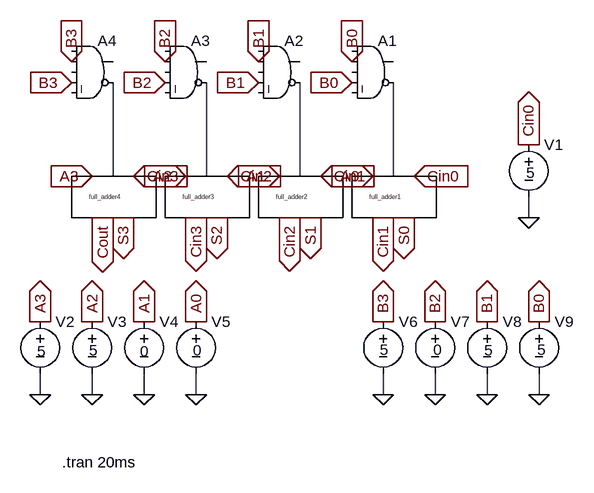
[diagram p0: schematic part3_simulatedCircuit.asc]
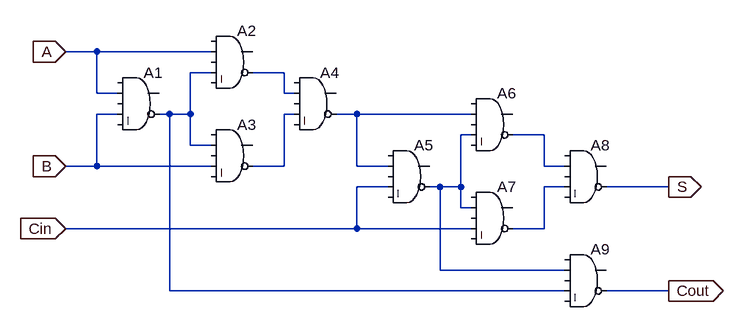
[diagram p1: sub-circuit part1_circuit.asc]
part3_simulatedCircuit.asc, the LTspice schematic file:
Version 4
SHEET 1 880 680
WIRE 0 144 0 0
WIRE 144 144 144 0
WIRE 288 144 288 0
WIRE 432 144 432 0
WIRE 640 208 640 176
WIRE -112 480 -112 448
WIRE -32 480 -32 448
WIRE 48 480 48 448
WIRE 128 480 128 448
WIRE 416 480 416 448
WIRE 496 480 496 448
WIRE 576 480 576 448
WIRE 656 480 656 448
FLAG 368 -32 B0
IOPIN 368 -32 In
FLAG 368 0 B0
IOPIN 368 0 In
FLAG 224 -32 B1
IOPIN 224 -32 In
FLAG 224 0 B1
IOPIN 224 0 In
FLAG 80 -32 B2
IOPIN 80 -32 In
FLAG 80 0 B2
IOPIN 80 0 In
FLAG -64 -32 B3
IOPIN -64 -32 In
FLAG -64 0 B3
IOPIN -64 0 In
FLAG 400 144 A0
IOPIN 400 144 In
FLAG 256 144 A1
IOPIN 256 144 In
FLAG 112 144 A2
IOPIN 112 144 In
FLAG -32 144 A3
IOPIN -32 144 In
FLAG 464 144 Cin0
IOPIN 464 144 In
FLAG 320 144 Cin1
IOPIN 320 144 In
FLAG 176 144 Cin2
IOPIN 176 144 In
FLAG 32 144 Cin3
IOPIN 32 144 In
FLAG 16 208 S3
IOPIN 16 208 Out
FLAG -16 208 Cout
IOPIN -16 208 Out
FLAG 128 208 Cin3
IOPIN 128 208 Out
FLAG 160 208 S2
IOPIN 160 208 Out
FLAG 272 208 Cin2
IOPIN 272 208 Out
FLAG 304 208 S1
IOPIN 304 208 Out
FLAG 416 208 Cin1
IOPIN 416 208 Out
FLAG 448 208 S0
IOPIN 448 208 Out
FLAG 640 208 0
FLAG 416 480 0
FLAG 496 480 0
FLAG 576 480 0
FLAG 656 480 0
FLAG 640 96 Cin0
IOPIN 640 96 Out
FLAG 416 368 B3
IOPIN 416 368 Out
FLAG 496 368 B2
IOPIN 496 368 Out
FLAG 576 368 B1
IOPIN 576 368 Out
FLAG 656 368 B0
IOPIN 656 368 Out
FLAG 128 480 0
FLAG 48 480 0
FLAG -32 480 0
FLAG -112 480 0
FLAG -112 368 A3
IOPIN -112 368 Out
FLAG -32 368 A2
IOPIN -32 368 Out
FLAG 48 368 A1
IOPIN 48 368 Out
FLAG 128 368 A0
IOPIN 128 368 Out
SYMBOL part1_circuit 432 176 R0
SYMATTR InstName full_adder1
SYMBOL part1_circuit 288 176 R0
SYMATTR InstName full_adder2
SYMBOL part1_circuit 144 176 R0
SYMATTR InstName full_adder3
SYMBOL part1_circuit 0 176 R0
SYMATTR InstName full_adder4
SYMBOL Digital\\and 400 -80 R0
SYMATTR InstName A1
SYMBOL Digital\\and 256 -80 R0
SYMATTR InstName A2
SYMBOL Digital\\and 112 -80 R0
SYMATTR InstName A3
SYMBOL Digital\\and -32 -80 R0
SYMATTR InstName A4
SYMBOL voltage 640 80 R0
WINDOW 123 0 0 Left 0
WINDOW 39 0 0 Left 0
WINDOW 3 -4 59 Left 2
SYMATTR InstName V1
SYMATTR Value 5
SYMBOL voltage 416 352 R0
WINDOW 123 0 0 Left 0
WINDOW 39 0 0 Left 0
WINDOW 3 -5 59 Left 2
SYMATTR InstName V6
SYMATTR Value 5
SYMBOL voltage 496 352 R0
WINDOW 123 0 0 Left 0
WINDOW 39 0 0 Left 0
WINDOW 3 -3 59 Left 2
SYMATTR InstName V7
SYMATTR Value 0
SYMBOL voltage 576 352 R0
WINDOW 123 0 0 Left 0
WINDOW 39 0 0 Left 0
WINDOW 3 -4 60 Left 2
SYMATTR InstName V8
SYMATTR Value 5
SYMBOL voltage 656 352 R0
WINDOW 123 0 0 Left 0
WINDOW 39 0 0 Left 0
WINDOW 3 -3 59 Left 2
SYMATTR InstName V9
SYMATTR Value 5
SYMBOL voltage -112 352 R0
WINDOW 3 -5 61 Left 2
WINDOW 123 0 0 Left 0
WINDOW 39 0 0 Left 0
SYMATTR InstName V2
SYMATTR Value 5
SYMBOL voltage -32 352 R0
WINDOW 3 -5 60 Left 2
WINDOW 123 0 0 Left 0
WINDOW 39 0 0 Left 0
SYMATTR InstName V3
SYMATTR Value 5
SYMBOL voltage 48 352 R0
WINDOW 3 -6 61 Left 2
WINDOW 123 0 0 Left 0
WINDOW 39 0 0 Left 0
SYMATTR InstName V4
SYMATTR Value 0
SYMBOL voltage 128 352 R0
WINDOW 3 -5 60 Left 2
WINDOW 123 0 0 Left 0
WINDOW 39 0 0 Left 0
SYMATTR InstName V5
SYMATTR Value 0
TEXT -78 584 Left 2 !.tran 20ms

part1_circuit.asc, the sub-circuit schematic file:
Version 4
SHEET 1 880 680
WIRE -128 32 -176 32
WIRE 48 32 -128 32
WIRE 48 64 16 64
WIRE 160 64 112 64
WIRE -128 96 -128 32
WIRE -96 96 -128 96
WIRE 160 96 160 64
WIRE 176 96 160 96
WIRE -96 128 -128 128
WIRE -16 128 -32 128
WIRE 16 128 16 64
WIRE 16 128 -16 128
WIRE 176 128 160 128
WIRE 272 128 240 128
WIRE 448 128 272 128
WIRE 448 160 432 160
WIRE 560 160 512 160
WIRE 16 176 16 128
WIRE 48 176 16 176
WIRE -128 208 -128 128
WIRE -128 208 -176 208
WIRE 48 208 -128 208
WIRE 160 208 160 128
WIRE 160 208 112 208
WIRE 272 208 272 128
WIRE 320 208 272 208
WIRE 560 208 560 160
WIRE 592 208 560 208
WIRE 320 240 272 240
WIRE 400 240 384 240
WIRE 432 240 432 160
WIRE 432 240 400 240
WIRE 592 240 560 240
WIRE 752 240 656 240
WIRE 432 272 432 240
WIRE 448 272 432 272
WIRE 272 304 272 240
WIRE 272 304 -176 304
WIRE 448 304 272 304
WIRE 560 304 560 240
WIRE 560 304 512 304
WIRE 400 368 400 240
WIRE 592 368 400 368
WIRE -16 400 -16 128
WIRE 592 400 -16 400
WIRE 752 400 656 400
FLAG -176 32 A
IOPIN -176 32 In
FLAG -176 208 B
IOPIN -176 208 In
FLAG -176 304 Cin
IOPIN -176 304 In
FLAG 752 240 S
IOPIN 752 240 Out
FLAG 752 400 Cout
IOPIN 752 400 Out
SYMBOL Digital\\and -64 48 R0
SYMATTR InstName A1
SYMBOL Digital\\and 80 -16 R0
SYMATTR InstName A2
SYMBOL Digital\\and 80 128 R0
SYMATTR InstName A3
SYMBOL Digital\\and 208 48 R0
SYMATTR InstName A4
SYMBOL Digital\\and 352 160 R0
SYMATTR InstName A5
SYMBOL Digital\\and 480 80 R0
SYMATTR InstName A6
SYMBOL Digital\\and 480 224 R0
SYMATTR InstName A7
SYMBOL Digital\\and 624 160 R0
SYMATTR InstName A8
SYMBOL Digital\\and 624 320 R0
SYMATTR InstName A9

The netlist it stands for:
* part3_simulatedCircuit.asc
Xfull_adder1 A0 N004 Cin0 Cin1 S0 part1_circuit
Xfull_adder2 A1 N003 Cin1 Cin2 S1 part1_circuit
Xfull_adder3 A2 N002 Cin2 Cin3 S2 part1_circuit
Xfull_adder4 A3 N001 Cin3 Cout S3 part1_circuit
A1 0 B0 0 B0 0 N004 0 0 AND
A2 0 B1 0 B1 0 N003 0 0 AND
A3 0 B2 0 B2 0 N002 0 0 AND
A4 0 B3 0 B3 0 N001 0 0 AND
V1 Cin0 0 5
V6 B3 0 5
V7 B2 0 0
V8 B1 0 5
V9 B0 0 5
V2 A3 0 5
V3 A2 0 5
V4 A1 0 0
V5 A0 0 0

* block symbol definitions
.subckt part1_circuit A B Cin Cout S
A1 0 A 0 B 0 N001 0 0 AND
A2 0 A 0 N001 0 N002 0 0 AND
A3 0 N001 0 B 0 N003 0 0 AND
A4 0 N002 0 N003 0 N004 0 0 AND
A5 0 N004 0 Cin 0 N005 0 0 AND
A6 0 N004 0 N005 0 N006 0 0 AND
A7 0 N005 0 Cin 0 N007 0 0 AND
A8 0 N006 0 N007 0 S 0 0 AND
A9 0 N005 0 N001 0 Cout 0 0 AND
.ends part1_circuit

.tran 20ms
.backanno
.end